# EAGLE design SparkFun Qwiic ToF Imager - VL53L5CX (EAGLE 9.6.2)
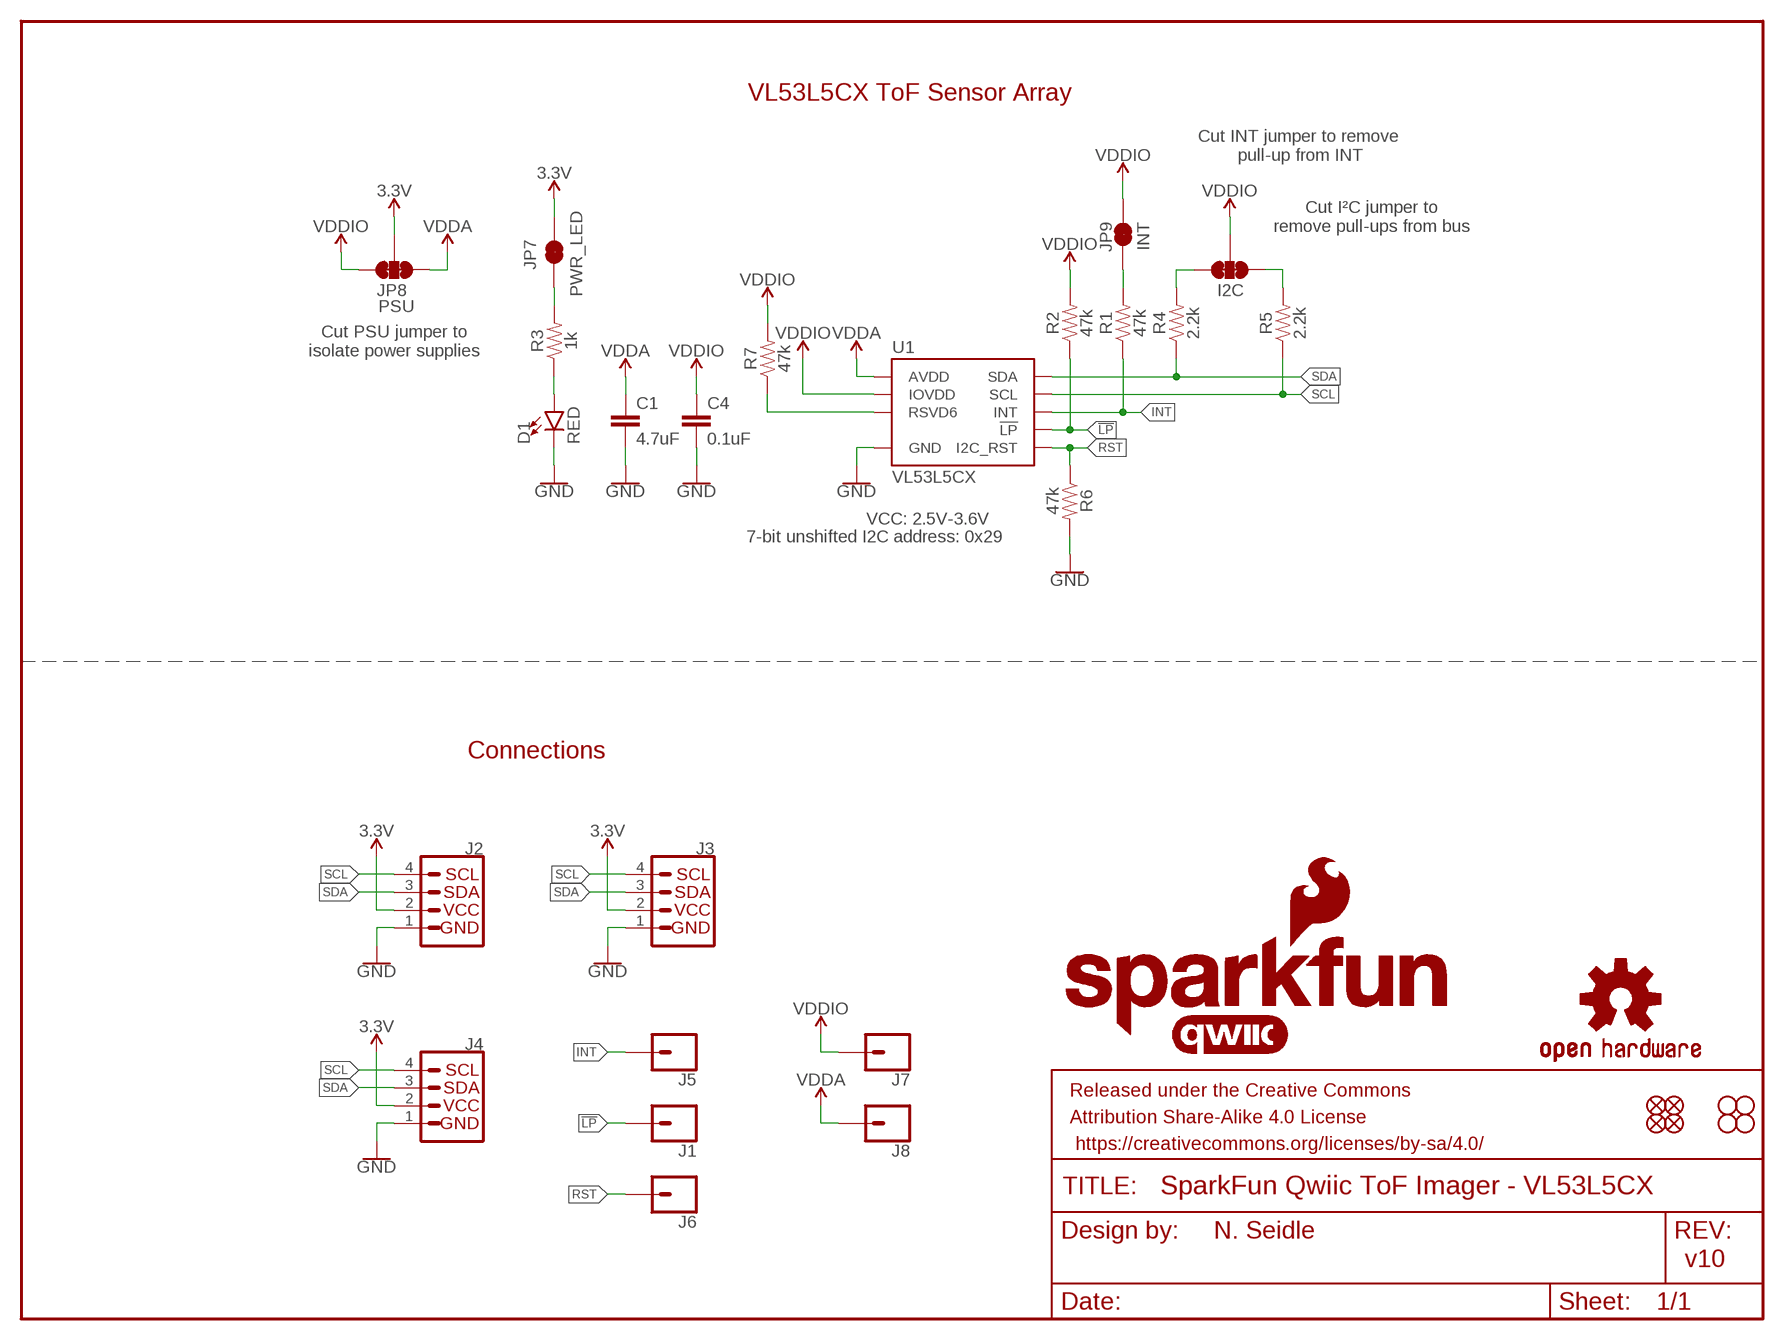
[diagram p0: schematic, sheet 1]

## Parts
C1  4.7uF  4.7UF-0603-6.3V-(10%)  [0603]
C4  0.1uF  0.1UF-0603-25V-(+80/-20%)  [0603]
D1  RED  LED-RED0603  [LED-0603]
FRAME1  FRAME-LETTER  [CREATIVE_COMMONS]
I2C  JUMPER-SMT_3_2-NC_TRACE_SILK  [SMT-JUMPER_3_2-NC_TRACE_SILK]
J1  CONN_01PTH_NO_SILK_YES_STOP  [1X01_NO_SILK]
J2  QWIIC_CONNECTORJS-1MM  [JST04_1MM_RA]
J3  PTH  I2C_STANDARD_NO_SILK  [1X04_NO_SILK]
J4  QWIIC_CONNECTORJS-1MM  [JST04_1MM_RA]
J5  CONN_01PTH_NO_SILK_YES_STOP  [1X01_NO_SILK]
J6  CONN_01PTH_NO_SILK_YES_STOP  [1X01_NO_SILK]
J7  CONN_01PTH_NO_SILK_YES_STOP  [1X01_NO_SILK]
J8  CONN_01PTH_NO_SILK_YES_STOP  [1X01_NO_SILK]
JP1  FIDUCIALUFIDUCIAL  [MICRO-FIDUCIAL]
JP2  FIDUCIALUFIDUCIAL  [MICRO-FIDUCIAL]
JP3  STAND-OFF  [STAND-OFF]
JP4  STAND-OFF  [STAND-OFF]
JP5  FIDUCIALUFIDUCIAL  [MICRO-FIDUCIAL]
JP6  FIDUCIALUFIDUCIAL  [MICRO-FIDUCIAL]
JP7  PWR_LED  JUMPER-SMT_2_NC_TRACE_SILK  [SMT-JUMPER_2_NC_TRACE_SILK]
JP8  PSU  JUMPER-SMT_3_2-NC_TRACE_SILK  [SMT-JUMPER_3_2-NC_TRACE_SILK]
JP9  INT  JUMPER-SMT_2_NC_TRACE_SILK  [SMT-JUMPER_2_NC_TRACE_SILK]
JP10  STAND-OFF  [STAND-OFF]
JP11  STAND-OFF  [STAND-OFF]
LOGO1  OSHW-LOGOMINI  [OSHW-LOGO-MINI]
LOGO3  QWIIC_LOGO_CONNECTOR  [QWIIC_5.5MM]
R1  47k  47KOHM-0603-1/10W-1%  [0603]
R2  47k  47KOHM-0603-1/10W-1%  [0603]
R3  1k  1KOHM-0603-1/10W-1%  [0603]
R4  2.2k  2.2KOHM-0603-1/10W-1%  [0603]
R5  2.2k  2.2KOHM-0603-1/10W-1%  [0603]
R6  47k  47KOHM-0603-1/10W-1%  [0603]
R7  47k  47KOHM-0603-1/10W-1%  [0603]
U1  VL53L5CX  [VL53L5CX]
U$1  SFE_LOGO_NAME.1_INCH  [SFE_LOGO_NAME_.1]
U$2  SFE_LOGO_NAME_FLAME.1_INCH  [SFE_LOGO_NAME_FLAME_.1]

## Nets
3.3V: J2.2 J3.2(VCC) J4.2 JP7.2 JP8.2
!LP: J1.1 R2.1 U1.A5(!LP)
GND: C1.2 C4.2 D1.C J2.1 J3.1(GND) J4.1 R6.2 U1.A2(GND) U1.A6(GND) U1.A7(GND) U1.B4(GND) U1.C1(GND) U1.C6(GND) U1.C7(GND)
INT: J5.1 R1.1 U1.A3(INT)
N$1: I2C.1 R5.2
N$2: I2C.3 R4.2
N$3: D1.A R3.1
N$4: JP9.1 R1.2
N$5: JP7.1 R3.2
N$6: R7.1 U1.C2(RSVD6)
RST: J6.1 R6.1 U1.A1(I2C_RST)
SCL: J2.4 J3.4(SCL) J4.4 R5.1 U1.C4(SCL)
SDA: J2.3 J3.3(SDA) J4.3 R4.1 U1.C3(SDA)
VDDA: C1.1 J8.1 JP8.1 U1.B1(AVDD) U1.B7(AVDD)
VDDIO: C4.1 I2C.2 J7.1 JP8.3 JP9.2 R2.2 R7.2 U1.A4(IOVDD)

## Notes on the sheet
- VL53L5CX ToF Sensor Array
- Cut INT jumper to remove 
  pull-up from INT
- Cut I²C jumper to
  remove pull-ups from bus
- Cut PSU jumper to
  isolate power supplies
- VCC: 2.5V-3.6V
- 7-bit unshifted I2C address: 0x29
- Connections
- N. Seidle
- v10

## Library data of the parts
C1 = SparkFun-Capacitors:4.7UF: 4.7µF ceramic capacitors A capacitor is a passive two-terminal electrical component used to store electrical energy temporarily in an electric field.; PROD_ID: CAP-08280
C4 = SparkFun-Capacitors:0.1UF: 0.1µF ceramic capacitors A capacitor is a passive two-terminal electrical component used to store electrical energy temporarily in an electric field.; PROD_ID: CAP-00810
D1 = SparkFun-LED:LED-RED: Red SMD LED Used in manufacturing of most products at SparkFun Packages: 0603 - SMD 0603 package [Product Link] <http://docs.avagotech.com/docs/AV02-0551EN> 0603 SMART - SMD 0603 SMART package ( more efficient and expensive)[Product Link] <http://www.osram-os.com/Graphics/XPic2/00077099_0.pdf> 1206 - SMD1206 package [Product Link] <https://www.sparkfun.com/datasheets/DevTools/LilyPad/Q150OVS4.pdff> SparkFun Products: Pro Mini 328 -5V <https://www.sparkfun.com/products/821> RedBoard <https://www.sparkfun.com/products/12757> IOIO-OTG <https://www.sparkfun.com/products/13613>; PROD_ID: DIO-00819
FRAME1 = SparkFun-Aesthetics:FRAME-LETTER: Schematic Frame - Letter Standard 8.5x11 US Letter frame
I2C JP8 = SparkFun-Jumpers:JUMPER-SMT_3_2-NC_TRACE: Normally closed trace jumper (2 of 2 connections) This jumper has a trace between all three pads so they are normally closed (NC). Use a razor knife to open the connection(s). For best results follow the IPC guidelines for cutting traces: Cutout at least 0.063 mm (0.005 in). Remove all loose material to clean up the cut area. Seal the cut with an approved epoxy. Reapply solder to reclose the connection(s).
J1 J5-J8 = SparkFun-Connectors:CONN_01: Single connection point. Often used as Generic Header-pin footprint for 0.1 inch spaced/style header connections On any of the 0.1 inch spaced packages, you can populate with these: Break Away Headers - Straight <https://www.sparkfun.com/products/116> (PRT-00116) Break Away Male Headers - Right Angle <https://www.sparkfun.com/products/553> (PRT-00553) Female Headers <https://www.sparkfun.com/products/115> (PRT-00115) Break Away Headers - Machine Pin <https://www.sparkfun.com/products/117> (PRT-00117) Break Away Female Headers - Swiss Machine Pin <https://www.sparkfun.com/products/743> (PRT-00743) This device is also useful as a general connection point to wire up your design to another part of your project. Our various solder wires solder well into these plated through hole pads. Hook-Up Wire - Assortment (Stranded, 22 AWG) <https://www.sparkfun.com/products/11375> (PRT-11375) Hook-Up Wire - Assortment (Solid Core, 22 AWG) <https://www.sparkfun.com/products/11367> (PRT-11367) View the entire wire category on our website here <https://www.sparkfun.com/categories/141> Special notes: SMTSO-256-ET is a "flush mount" nut for a 4-40 screw. We mostly use this on specialty testbeds; it is a nice way to connect hardware to your PCB at an adjustable hieght. Also note, the SNAP packages are for using a snappable style connector. We sell a baggie of snaps and they are also used on two LilyPad designs: Snap Assortment - 30 pack (male and female) <https://www.sparkfun.com/products/11347> (DEV-11347) LilyPad Arduino SimpleSnap <https://www.sparkfun.com/products/10941> (DEV-10941) LilyPad SimpleSnap Protoboard <https://www.sparkfun.com/products/10940> (DEV-10940)
J2 J4 = SparkFun-Connectors:QWIIC_CONNECTOR: SparkFun I2C Standard Qwiic Connector An SMD 1mm pitch JST connector makes it easy and quick (get it? Qwiic?) to connect I2C devices to each other. The Qwiic system <http://www.sparkfun.com/qwiic> enables fast and solderless connection between popular platforms and various sensors and actuators. We carry 200mm <https://www.sparkfun.com/products/14204>, 100mm <https://www.sparkfun.com/products/14205>, 50mm <https://www.sparkfun.com/products/14206>, and breadboard friendly <https://www.sparkfun.com/products/14207> Qwiic cables. We also offer 10 pcs strips <https://www.sparkfun.com/products/14323> the SMD connectors.; PROD_ID: CONN-13694; VALUE: QWIIC_RIGHT_ANGLE
J3 = SparkX:I2C_STANDARD: SparkFun I2C Standard Pinout Header SparkFun has standardized on a pinout for all I2C based sensor breakouts. This pinout allows I2C boards to be plugged directly into the headers on Arduino Uno compatible boards, and to be daisy chained easily. Example SparkFun Products: SparkFun Atmospheric Sensor Breakout - BME280 <https://www.sparkfun.com/products/13676> SparkFun Altitude/Pressure Sensor Breakout - MPL3115A2 <https://www.sparkfun.com/products/11084> SparkFun TOF Range Finder Sensor - VL6180 <https://www.sparkfun.com/products/12785>
JP1 JP2 JP5 JP6 = SparkFun:FIDUCIAL: Fiducial Alignment Points Various fiducial points for machine vision alignment.
JP3 JP4 JP10 JP11 = SparkFun:STAND-OFF: Stand Off This is the mechanical footprint for a #4 phillips button head screw. Use the keepout ring to avoid running the screw head into surrounding components. SKU : PRT-00447
JP7 JP9 = SparkFun-Jumpers:JUMPER-SMT_2_NC_TRACE: Normally closed trace jumper This jumper has a trace between two pads so it's normally closed (NC). Use a razor knife to open the connection. For best results follow the IPC guidelines for cutting traces: Cutout at least 0.063 mm (0.005 in). Remove all loose material to clean up the cut area. Seal the cut with an approved epoxy. Reapply solder to reclose the connection.
LOGO1 = SparkFun-Aesthetics:OSHW-LOGO: Open-Source Hardware (OSHW) Logo This logo indicates the piece of hardware it is found on incorporates a OSHW license and/or adheres to the definition of open source hardware found here: http://freedomdefined.org/OSHW
LOGO3 = SparkFun-Aesthetics:QWIIC_LOGO: Qwiic Logos for placement on schematic and PCB. The 5.5mm silk logo is best for placing next to Qwiic connector.
R1 R2 R6 R7 = SparkFun-Resistors:47KOHM: 47kΩ resistor A resistor is a passive two-terminal electrical component that implements electrical resistance as a circuit element. Resistors act to reduce current flow, and, at the same time, act to lower voltage levels within circuits. - Wikipedia; PROD_ID: RES-07871
R3 = SparkFun-Resistors:1KOHM: 1kΩ resistor A resistor is a passive two-terminal electrical component that implements electrical resistance as a circuit element. Resistors act to reduce current flow, and, at the same time, act to lower voltage levels within circuits. - Wikipedia; PROD_ID: RES-07856
R4 R5 = SparkFun-Resistors:2.2KOHM: 2.2kΩ resistor A resistor is a passive two-terminal electrical component that implements electrical resistance as a circuit element. Resistors act to reduce current flow, and, at the same time, act to lower voltage levels within circuits. - Wikipedia; PROD_ID: RES-08272
U1 = SparkFun-Sensors:VL53L5CX; PROD_ID: IC-16254
U$1 = SparkFun-Aesthetics:SFE_LOGO_NAME: SparkFun Font Logo This is the SparkFun name logo. The logo on the schematic will always be the same size; the package variant is the height of the flame part of the logo (or the height the flame would be, if it were drawn). Default layer for the logo on the board is tSilk.
U$2 = SparkFun-Aesthetics:SFE_LOGO_NAME_FLAME: SparkFun Font Logo w/ Flame This is the SparkFun full logo. The logo on the schematic will always be the same size; the package variant is the height of the flame part of the logo. Default layer for the logo on the board is tSilk.

## Net classes
1 power: width 0.203 mm

## Board
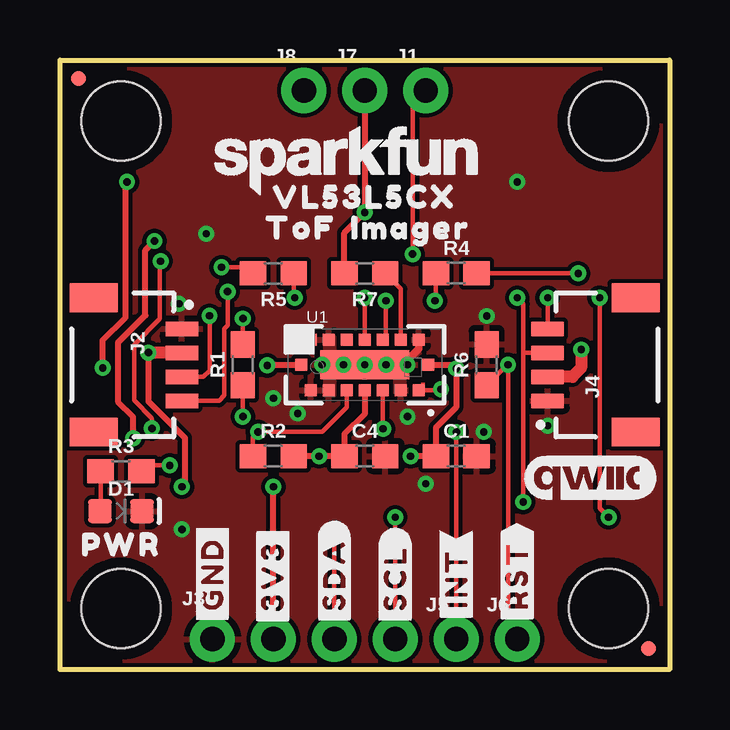
[diagram p1: board, top side]
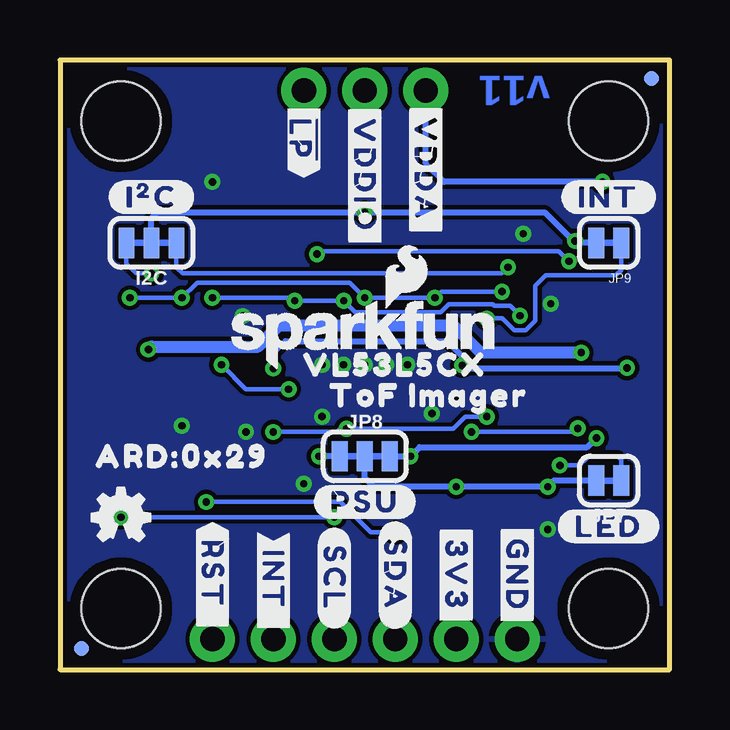
[diagram p2: board, bottom side, seen from below]

Size 25.4 x 25.4 mm. Coordinates in mm from the lower left corner, seen from the top.
Outline: 0,0 0,25.4 25.4,25.4 25.4,0 0,0
Copper layers (1*16): Top/Vert 0.035mm / dielectric 1.5mm / Bottom/Horz 0.035mm
Design rules "SparkFun-2-Layer-General-JLCPCB": minimum track width 7mil, minimum drill 0.3mm, track to track 7mil, track to pad 7mil, pad to pad 7mil, via to via 7mil, smd to smd 7mil, copper to edge 7mil, drill to drill 7mil, minimum pad ring 7mil, minimum via ring 7mil, stop-mask expansion 3mil, vias tented up to drill 25mil, thermal gap 10mil

### Footprints (pad centres in the part's own frame; a part is rotated, then mirrored left to right if it is on the bottom)
0603 = smd 1.1 x 1: 1 -0.85,0; 2 0.85,0
LED-0603 = smd 1 x 1: A -0.877,0; C 0.877,0
SMT-JUMPER_3_2-NC_TRACE_SILK = smd 0.66 x 1.27: 1 -1.041,0; 2 0,0; 3 1.041,0
1X01_NO_SILK = drill 1.016 pad 1.88: 1 0,0
JST04_1MM_RA = smd 0.6 x 1.35: 1 -1.5,0; 2 -0.5,0; 3 0.5,0; 4 1.5,0 | smd 1.2 x 2: NC1 2.8,-3.675; NC2 -2.8,-3.675
1X04_NO_SILK = drill 1.016 pad 1.88: 1 0,0; 2 2.54,0; 3 5.08,0; 4 7.62,0
MICRO-FIDUCIAL = smd 0.635 x 0.635: 1 0,0
STAND-OFF = hole 3.302: 0,0
SMT-JUMPER_2_NC_TRACE_SILK = smd 0.66 x 1.27: 1 -0.521,0; 2 0.521,0
VL53L5CX = smd 0.5 x 0.5: A1 2.25,-1.05; A2 1.5,-1.05; A3 0.75,-1.05; A4 0,-1.05; A5 -0.75,-1.05; A6 -1.5,-1.05; A7 -2.25,-1.05; B1 2.65,0; B7 -2.65,0; C1 2.25,1.05; C2 1.5,1.05; C3 0.75,1.05; C4 0,1.05; C5 -0.75,1.05; C6 -1.5,1.05; C7 -2.25,1.05 | smd 3.7 x 1.2: B4 0,0

### Placement (x,y rotation side)
C1  16.51,8.89 0 top
C4  12.7,8.89 0 top
D1  2.54,6.6 0 top
FRAME1  -15.24,-8.89 0 top  (outside the outline)
I2C  21.59,17.78 180 bottom
J1  15.24,24.13 0 top
J2  5.08,12.7 270 top
J3  6.35,1.27 0 top
J4  20.32,12.7 90 top
J5  16.51,1.27 0 top
J6  19.05,1.27 0 top
J7  12.7,24.13 0 top
J8  10.16,24.13 0 top
JP1  0.76,24.64 0 bottom
JP2  24.51,0.89 0 top
JP3  2.54,22.86 0 top
JP4  22.86,22.86 0 top
JP5  24.51,0.89 0 bottom
JP6  0.76,24.64 0 top
JP7  2.54,7.87 180 bottom
JP8  12.7,8.89 0 bottom
JP9  2.54,17.78 180 bottom
JP10  2.54,2.54 0 top
JP11  22.86,2.54 0 top
LOGO1  22.86,6.35 0 bottom
LOGO3  22.1,8 0 top
R1  7.62,12.7 90 top
R2  8.89,8.89 0 top
R3  2.54,8.26 0 top
R4  16.51,16.51 0 top
R5  8.89,16.51 180 top
R6  17.78,12.7 90 top
R7  12.7,16.51 180 top
U1  12.7,12.7 0 top
U$1  11.94,21.21 0 top
U$2  12.7,13.97 0 bottom
U$3  [#3V3#13]  8.89,3.94 270 bottom
U$4  [PWR12]  2.54,5.21 0 top
U$5  [#LED#10]  2.54,5.97 0 bottom
U$6  [#INT#0]  16.51,3.81 90 top
U$7  [#RST#1]  19.05,3.94 90 top
U$8  [#INT_#0]  16.51,3.56 270 bottom
U$9  [#RST_#1]  19.05,3.81 270 bottom
U$10  [##LP##2]  15.24,22.1 270 bottom
U$11  [#INT#1]  2.54,19.68 0 bottom
U$12  [#VDDA#0]  10.16,20.83 270 bottom
U$14  [#VDDIO#1]  12.7,20.57 270 bottom
U$15  [#PSU#0]  12.7,6.99 0 bottom
U$16  [#I�C#0]  21.59,19.68 0 bottom
U$17  [VL53L5CX0]  12.7,19.68 0 top
U$18  [IMAGER2]  14.61,18.41 0 top
U$19  [VL53L5CX0]  11.43,12.7 0 bottom
U$20  [TOF1]  12.7,11.43 0 bottom
U$21  [#3V3#13]  8.86,3.89 90 top
U$22  [IMAGER2]  8.38,11.43 0 bottom
U$23  [TOF1]  10.03,18.41 0 top
U$24  [#SCL#1]  13.97,3.81 270 bottom
U$25  [#SDA#0]  11.43,3.94 270 bottom
U$26  [#GND#62130]  6.35,3.99 90 top
U$27  [ARD#0X290]  20.32,8.89 0 bottom
U$28  [#SDA#62131]  11.43,3.96 90 top
U$29  [#SCL#62132]  13.97,3.81 90 top
U$30  [#GND#62130]  6.35,3.94 270 bottom

### Tracks (layer width: path | path; a pad name or v marks a point on that pad's centre or on a via)
3.3V  (via drill 0.3)
  Top/Vert 0.254: J3.2 v8.89,7.62 | v3.68,13.21 3.68,11.18 5.21,9.65 5.21,7.75 v5.08,7.62
  Top/Vert 0.305: 3.69,13.2 v3.68,13.21
  Top/Vert 0.508: J2.2 3.69,13.2 | v21.72,13.34 21.72,12.57 21.34,12.2 J4.2
  Bottom/Horz 0.254: JP7.2 4.83,7.87 v5.08,7.62 v8.89,7.62 12.32,7.62 12.7,8 JP8.2
  Bottom/Horz 0.305: v21.72,13.34 21.59,13.46
  Bottom/Horz 0.508: v3.68,13.21 7.87,13.21 9.02,14.35 16.26,14.35 17.14,13.46 21.59,13.46
!LP  (via drill 0.3)
  Top/Vert 0.178: U1.A5 11.95,10.93 10.92,9.91 v8.26,9.91 8.04,9.69 R2.1 | J1.1 14.69,23.58 v14.69,17.31 | v3.83,10.05 3.83,10.47 3.09,11.22 3.09,13.54 4.15,14.61 4.15,16.98 v4.19,17.02
  Bottom/Horz 0.178: v4.19,17.02 4.61,17.44 14.57,17.44 v14.69,17.31 | v8.26,9.91 3.97,9.91 v3.83,10.05
GND  (via drill 0.3)
  Top/Vert 0.305: v14.48,12.7 14.48,12.89 14.95,13.37 U1.C1
  other vias: 20.32,10.16 17.78,14.73 14.48,10.54 17.65,9.91 5.08,5.84 11.81,12.7 12.7,12.7 4.95,15.24 8.89,11.3 6.1,18.16 19.05,20.32 15.24,7.75 10.92,12.7 13.59,12.7 9.91,10.67
  pour Bottom/Horz (isolate 0.178): 0,0 0,25.4 25.4,25.4 25.4,0
  pour Top/Vert (isolate 0.178): 0,0 0,25.4 25.4,25.4 25.4,0
  pour Top/Vert (isolate 0.178, no thermals): 11.05,13.84 11.05,11.43 11.43,11.43 11.43,13.84
  pour Top/Vert (isolate 0.178, no thermals): 13.97,12.83 13.97,11.56 14.35,11.56 14.35,12.83
INT  (via drill 0.3)
  Top/Vert 0.178: U1.A3 13.45,10.04 v13.46,10.03 | v7.62,10.54 R1.1 | J5.1 v16.51,9.9 v16.52,9.9
  Bottom/Horz 0.178: v7.62,10.54 8.51,10.54 9.02,10.03 v13.46,10.03 13.72,10.03 13.85,9.9 v16.52,9.9
N$1  (via drill 0.3)
  Top/Vert 0.178: R5.2 7.79,16.76 v6.73,16.76
  Bottom/Horz 0.178: v6.73,16.76 6.99,16.51 20.3,16.51 20.55,16.76 I2C.1
N$2  (via drill 0.3)
  Top/Vert 0.178: R4.2 v21.59,16.51
  Bottom/Horz 0.178: v21.59,16.51 22.23,16.51 22.63,16.92 I2C.3
N$3
  Top/Vert 0.178: R3.1 1.69,6.63 D1.A
N$4  (via drill 0.3)
  Top/Vert 0.178: R1.2 v7.62,14.63
  Bottom/Horz 0.178: JP9.1 2.02,16.65 2.25,16.42 5.17,16.42 5.59,16 5.59,14.54 5.99,14.14 6.48,14.14 6.97,14.63 v7.62,14.63
N$5  (via drill 0.3)
  Top/Vert 0.178: R3.2 3.64,8.51 v4.57,8.51
  Bottom/Horz 0.178: v4.57,8.51 3.77,8.51 3.4,8.88 2.15,8.88 2.02,8.75 JP7.1
N$6
  Top/Vert 0.178: U1.C2 14.2,15.86 R7.1
RST  (via drill 0.3)
  Top/Vert 0.178: U1.A1 15.88,11.65 v15.88,11.68 | R6.1 18.63,12.7 v18.67,12.7 18.67,1.65 J6.1
  Bottom/Horz 0.178: v18.67,12.7 17.65,11.68 v15.88,11.68
SCL  (via drill 0.3)
  Top/Vert 0.178: U1.C4 v12.7,15.49 | v20.32,15.49 J4.4 | R5.1 9.74,15.53 v9.78,15.49 | v6.99,15.75 6.99,14.34 6.85,14.21 6.85,11.43 6.63,11.2 J2.4 | J3.4 v13.97,6.35 | v22.86,6.35 22.49,6.72 v22.49,15.49
  Bottom/Horz 0.178: v6.99,15.75 9.53,15.75 v9.78,15.49 v12.7,15.49 13.34,16.13 19.68,16.13 v20.32,15.49 v22.49,15.49 | v13.97,6.35 v22.86,6.35
SDA  (via drill 0.3)
  Top/Vert 0.178: U1.C3 13.58,13.88 v13.58,15.37 | R4.1 15.66,15.41 v15.62,15.37 | J2.3 5.98,12.2 6.23,12.46 v6.23,14.74 | J3.3 v11.43,5.71 | v19.05,15.49 19.3,15.24 19.3,13.21 | v19.3,6.99 19.3,13.21 | J4.3 19.31,13.2 19.3,13.21
  Bottom/Horz 0.178: v19.05,15.49 15.75,15.49 v15.62,15.37 v13.58,15.37 13.11,14.9 9.53,14.9 9.2,15.23 7.37,15.23 7.3,15.15 6.64,15.15 v6.23,14.74 | v11.43,5.71 12.45,5.71 13.72,6.99 v19.3,6.99
VDDA  (via drill 0.3)
  Top/Vert 0.254: U1.B1 16.38,12.7 16.51,12.57 v16.51,12.55 16.51,10.92 15.66,10.07 C1.1 v14.61,8.89 | U1.B7 10.03,12.68 v8.64,12.68 | v1.78,12.57 1.78,13.71 2.71,14.65 2.71,20.24 v2.79,20.32
  Bottom/Horz 0.254: JP8.1 v14.61,8.89 | v16.51,12.55 16.51,13.18 16,13.69 9.27,13.69 8.64,13.06 v8.64,12.68 8.51,12.55 1.8,12.55 v1.78,12.57 | v2.79,20.32 9.4,20.32 10.16,21.08 J8.1
VDDIO  (via drill 0.3)
  Top/Vert 0.254: J7.1 v12.7,19.05 11.85,18.2 R7.2 | U1.A4 12.7,10.67 11.85,9.82 C4.1 v10.79,8.89 R2.2 | v3.05,9.64 3.05,10.53 2.41,11.17 2.41,13.61 3.56,14.76 3.56,17.48 v3.94,17.86
  Bottom/Horz 0.254: JP8.3 v10.79,8.89 10.41,9.27 3.42,9.27 v3.05,9.64 | I2C.2 21.59,18.8 21.34,19.05 v12.7,19.05 5.21,19.05 3.94,17.78 | JP9.2 3.94,17.78 | v3.94,17.86 3.94,17.78

### Text on the board
Bottom/Horz: v11
tDocu: N. Seidle